# Altium schematic sheet CurrentDivider.SchDoc
size A4; SheetNumber: 1; SheetTotal: 4
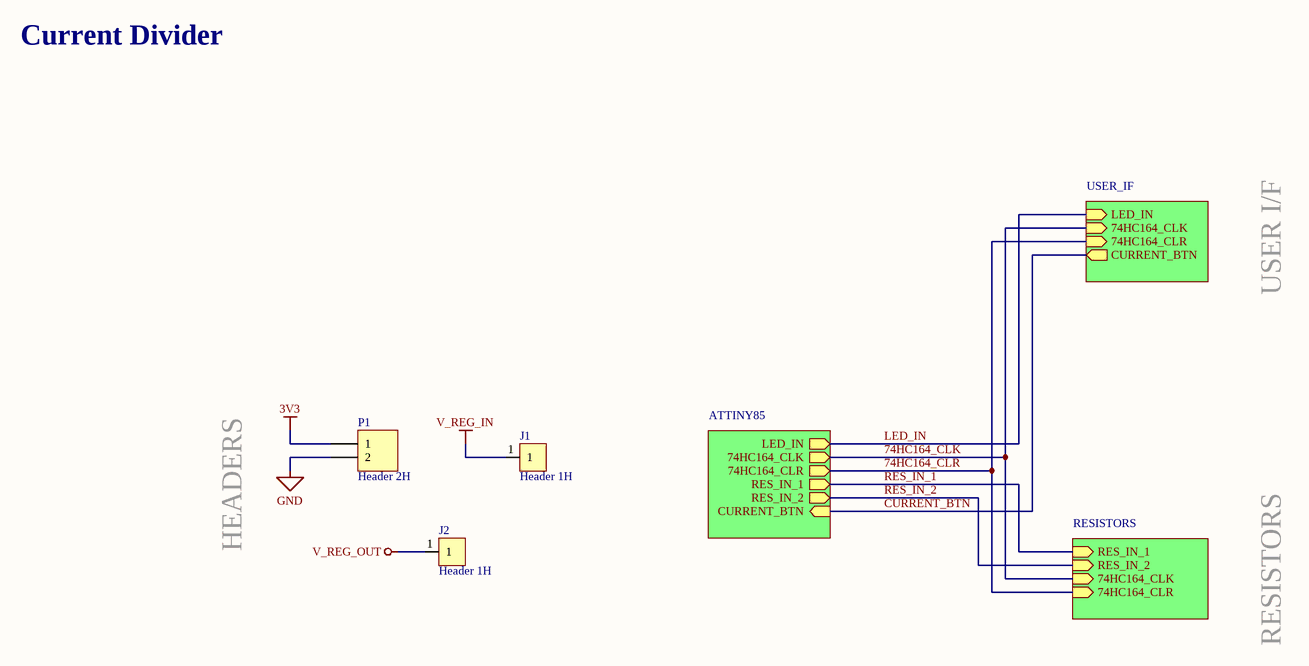
[diagram p0: CurrentDivider.SchDoc]

## Parts
J1  Header 1H
J2  Header 1H
P1  Header 2H  [HDR1X2H]

## Sub-sheets
ATTINY85 = ATTINY85.SchDoc: LED_IN (out), 74HC164_CLK (out), 74HC164_CLR (out), RES_IN_1 (out), RES_IN_2 (out), CURRENT_BTN (in)
RESISTORS = RESISTORS.SchDoc: RES_IN_1 (in), 74HC164_CLK (in), 74HC164_CLR (in), RES_IN_2 (in)
USER_IF = USER_IF.SchDoc: LED_IN (in), 74HC164_CLK (in), 74HC164_CLR (in), CURRENT_BTN (out)

## Nets
3V3: P1.1
GND: P1.2
V_REG_IN: J1.1
V_REG_OUT: J2.1
74HC164_CLK: sheet USER_IF/74HC164_CLK, sheet ATTINY85/74HC164_CLK, sheet RESISTORS/74HC164_CLK
74HC164_CLR: sheet USER_IF/74HC164_CLR, sheet ATTINY85/74HC164_CLR, sheet RESISTORS/74HC164_CLR
CURRENT_BTN: sheet USER_IF/CURRENT_BTN, sheet ATTINY85/CURRENT_BTN
LED_IN: sheet USER_IF/LED_IN, sheet ATTINY85/LED_IN
RES_IN_1: sheet ATTINY85/RES_IN_1, sheet RESISTORS/RES_IN_1
RES_IN_2: sheet ATTINY85/RES_IN_2, sheet RESISTORS/RES_IN_2

## Notes on the sheet
- Current Divider
- USER I/F
- HEADERS
- RESISTORS

## Library data of the parts
J1 J2 = Header, 1-Pin
P1 = Header 2H: Header, 2-Pin, Right Angle; LatestRevisionDate: 17-Jul-2002; LatestRevisionNote: Re-released for DXP Platform.; Publisher: Altium Limited